# EAGLE design DapLink (EAGLE 9.2.2)

## Sheet 1 of 2
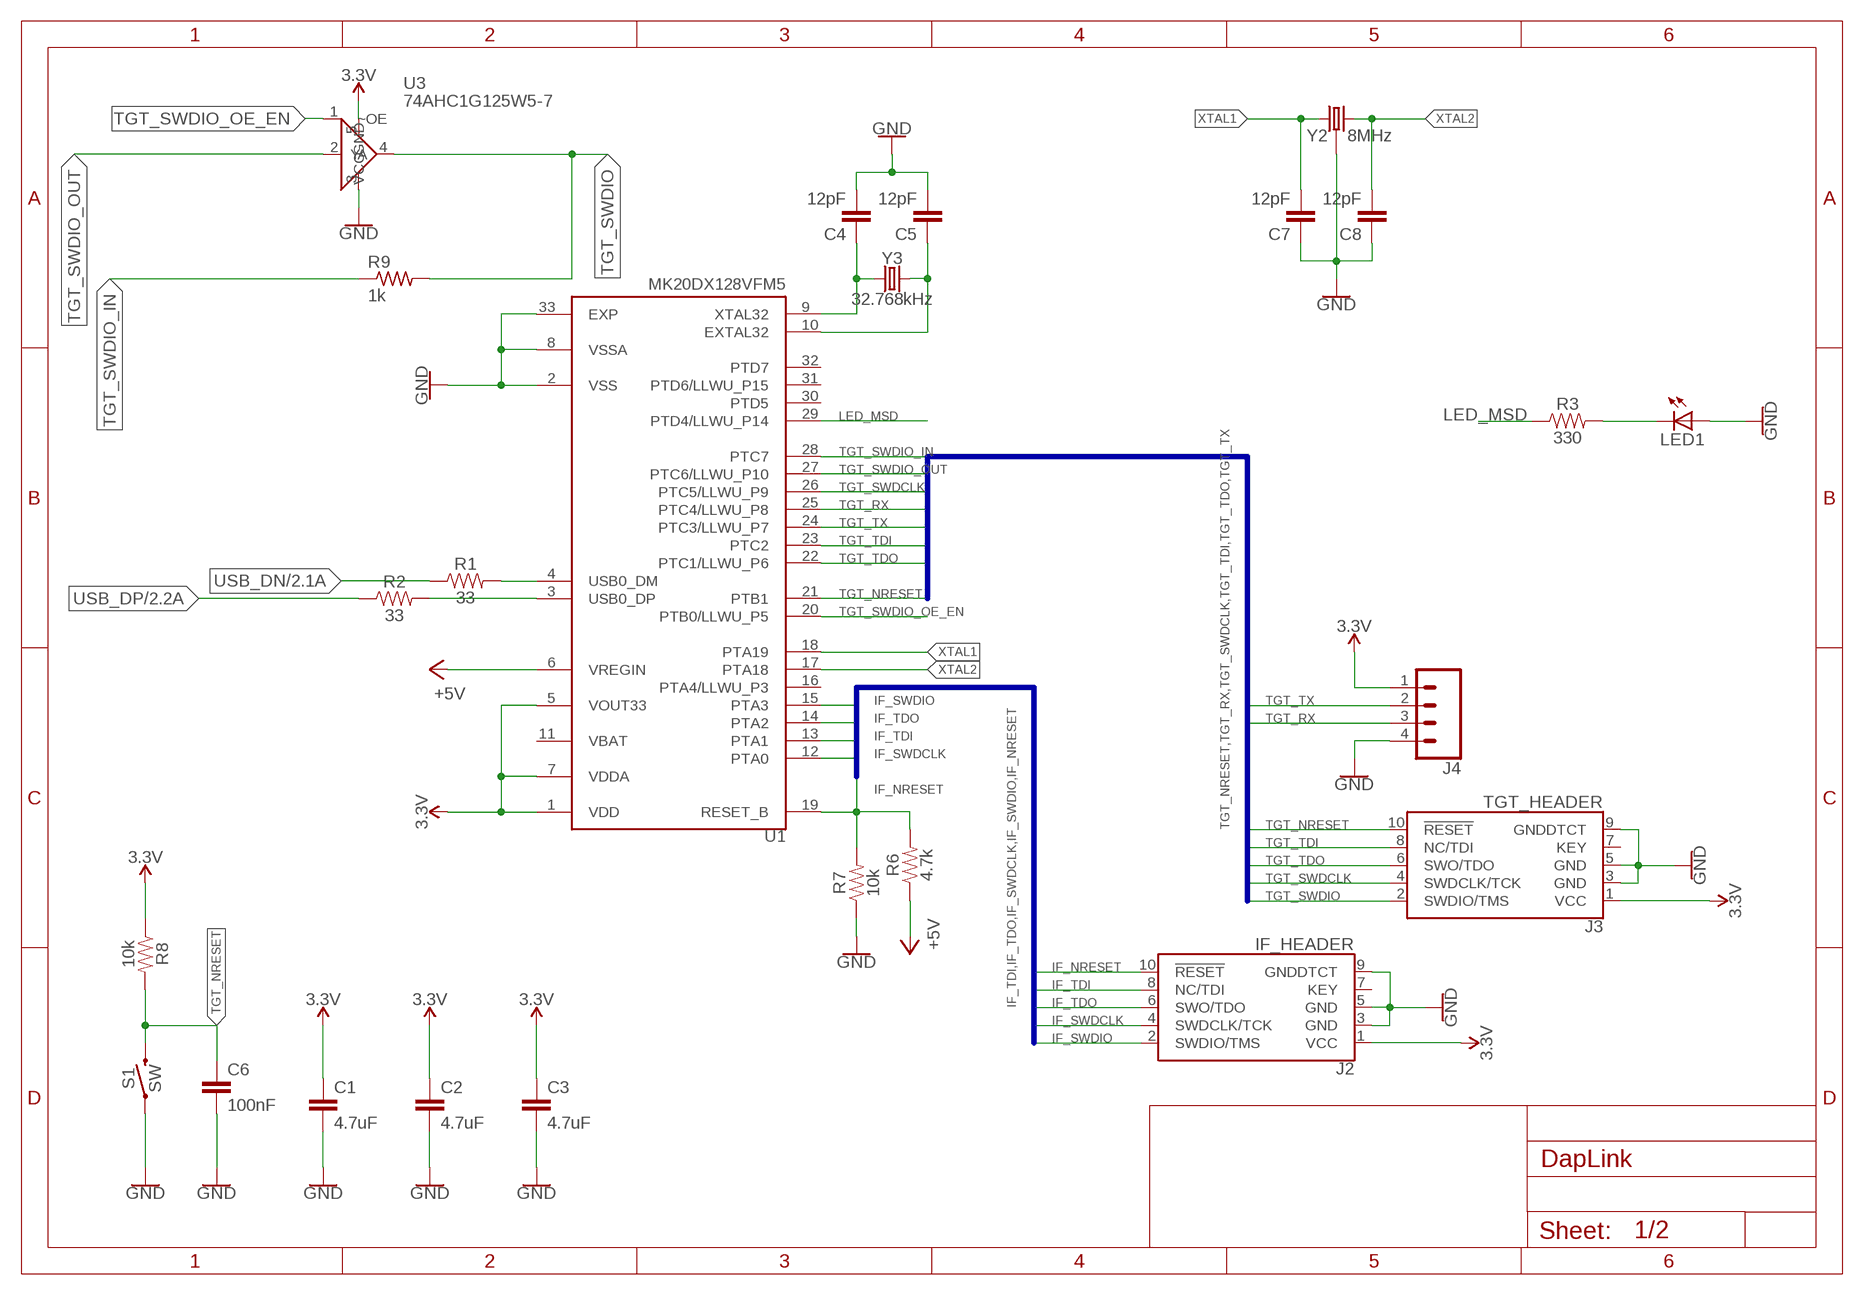
[diagram p0: schematic, sheet 1]

### Parts
C1  4.7uF  4.7UF0603  [0603]
C2  4.7uF  4.7UF0603  [0603]
C3  4.7uF  4.7UF0603  [0603]
C4  12pF  4.7UF0603  [0603]
C5  12pF  4.7UF0603  [0603]
C6  100nF  4.7UF0603  [0603]
C7  12pF  4.7UF0603  [0603]
C8  12pF  4.7UF0603  [0603]
J2  IF_HEADER  CORTEX_DEBUG_PTH  [2X5-PTH-1.27MM]
J3  TGT_HEADER  CORTEX_DEBUG_PTH  [2X5-PTH-1.27MM]
J4  CONN_04  [1X04]
LED1  LEDCHIP-LED0603  [CHIP-LED0603]
R1  33  1KOHM-0603-1/10W-1%  [0603]
R2  33  1KOHM-0603-1/10W-1%  [0603]
R3  330  1KOHM-0603-1/10W-1%  [0603]
R6  4.7k  1KOHM-0603-1/10W-1%  [0603]
R7  10k  1KOHM-0603-1/10W-1%  [0603]
R8  10k  1KOHM-0603-1/10W-1%  [0603]
R9  1k  R-US_R0603  [R0603]
S1  SW  MOMENTARY-SWITCH-SPST-PTH-6.0MM-KIT  [TACTILE_SWITCH_PTH_6.0MM_KIT]
U1  MK20DX128VFM5  [QFN50P500X500X100-33N]
U3  74AHC1G125W5-7  [SOT95P280X140-5N]
Y2  8MHz  CRYSTAL-GROUNDEDSMD-5X3.2  [CRYSTAL-SMD-5X3.2-4PAD]
Y3  32.768kHz  CRYSTAL-32.768KHZSMD-3.2X1.5  [CRYSTAL-SMD-3.2X1.5MM]

### Nets
3.3V: C1.1 C2.1 C3.1 J2.1(VCC) J3.1(VCC) J4.1 R8.1 U1.1(VDD) U1.5(VOUT33) U1.7(VDDA) U3.5(VCC) ; also sheet 2
+5V: R6.1 U1.6(VREGIN) ; also sheet 2
GND: C1.2 C2.2 C3.2 C4.2 C5.2 C6.2 C7.1 C8.1 J2.3(GND) J2.5(GND) J2.9(GNDDTCT) J3.3(GND) J3.5(GND) J3.9(GNDDTCT) J4.4 LED1.A R7.1 S1.1 U1.2(VSS) U1.8(VSSA) U1.33(EXP) U3.3(GND) Y2.2 Y2.4 ; also sheet 2
IF_NRESET: J2.10(!RESET) R6.2 R7.2 U1.19(RESET_B)
IF_SWDCLK: J2.4(SWDCLK/TCK) U1.12(PTA0)
IF_SWDIO: J2.2(SWDIO/TMS) U1.15(PTA3)
IF_TDI: J2.8(NC/TDI) U1.13(PTA1)
IF_TDO: J2.6(SWO/TDO) U1.14(PTA2)
LED_MSD: R3.1 U1.29(PTD4/LLWU_P14)
N$1: C4.1 U1.9(XTAL32) Y3.P$1
N$2: C5.1 U1.10(EXTAL32) Y3.P$2
N$3: LED1.C R3.2
TGT_NRESET: C6.1 J3.10(!RESET) R8.2 S1.3 U1.21(PTB1)
TGT_RX: J4.3 U1.25(PTC4/LLWU_P8)
TGT_SWDCLK: J3.4(SWDCLK/TCK) U1.26(PTC5/LLWU_P9)
TGT_SWDIO: J3.2(SWDIO/TMS) R9.2 U3.4(Y)
TGT_SWDIO_IN: R9.1 U1.28(PTC7)
TGT_SWDIO_OE_EN: U1.20(PTB0/LLWU_P5) U3.1(~OE)
TGT_SWDIO_OUT: U1.27(PTC6/LLWU_P10) U3.2(A)
TGT_TDI: J3.8(NC/TDI) U1.23(PTC2)
TGT_TDO: J3.6(SWO/TDO) U1.22(PTC1/LLWU_P6)
TGT_TX: J4.2 U1.24(PTC3/LLWU_P7)
USB0_DN [usb]: R1.2 U1.4(USB0_DM)
USB0_DP [usb]: R2.2 U1.3(USB0_DP)
USB_DN [usb]: R1.1 ; also sheet 2
USB_DP [usb]: R2.1 ; also sheet 2
XTAL1: C7.2 U1.18(PTA19) Y2.3
XTAL2: C8.2 U1.17(PTA18) Y2.1
Unconnected: J2.7(KEY) J3.7(KEY) U1.16(PTA4/LLWU_P3) U1.30(PTD5) U1.31(PTD6/LLWU_P15) U1.32(PTD7)

### Buses
IF_TDI,IF_TDO,IF_SWDCLK,IF_SWDIO,IF_NRESET
TGT_NRESET,TGT_RX,TGT_SWDCLK,TGT_TDI,TGT_TDO,TGT_TX

## Sheet 2 of 2
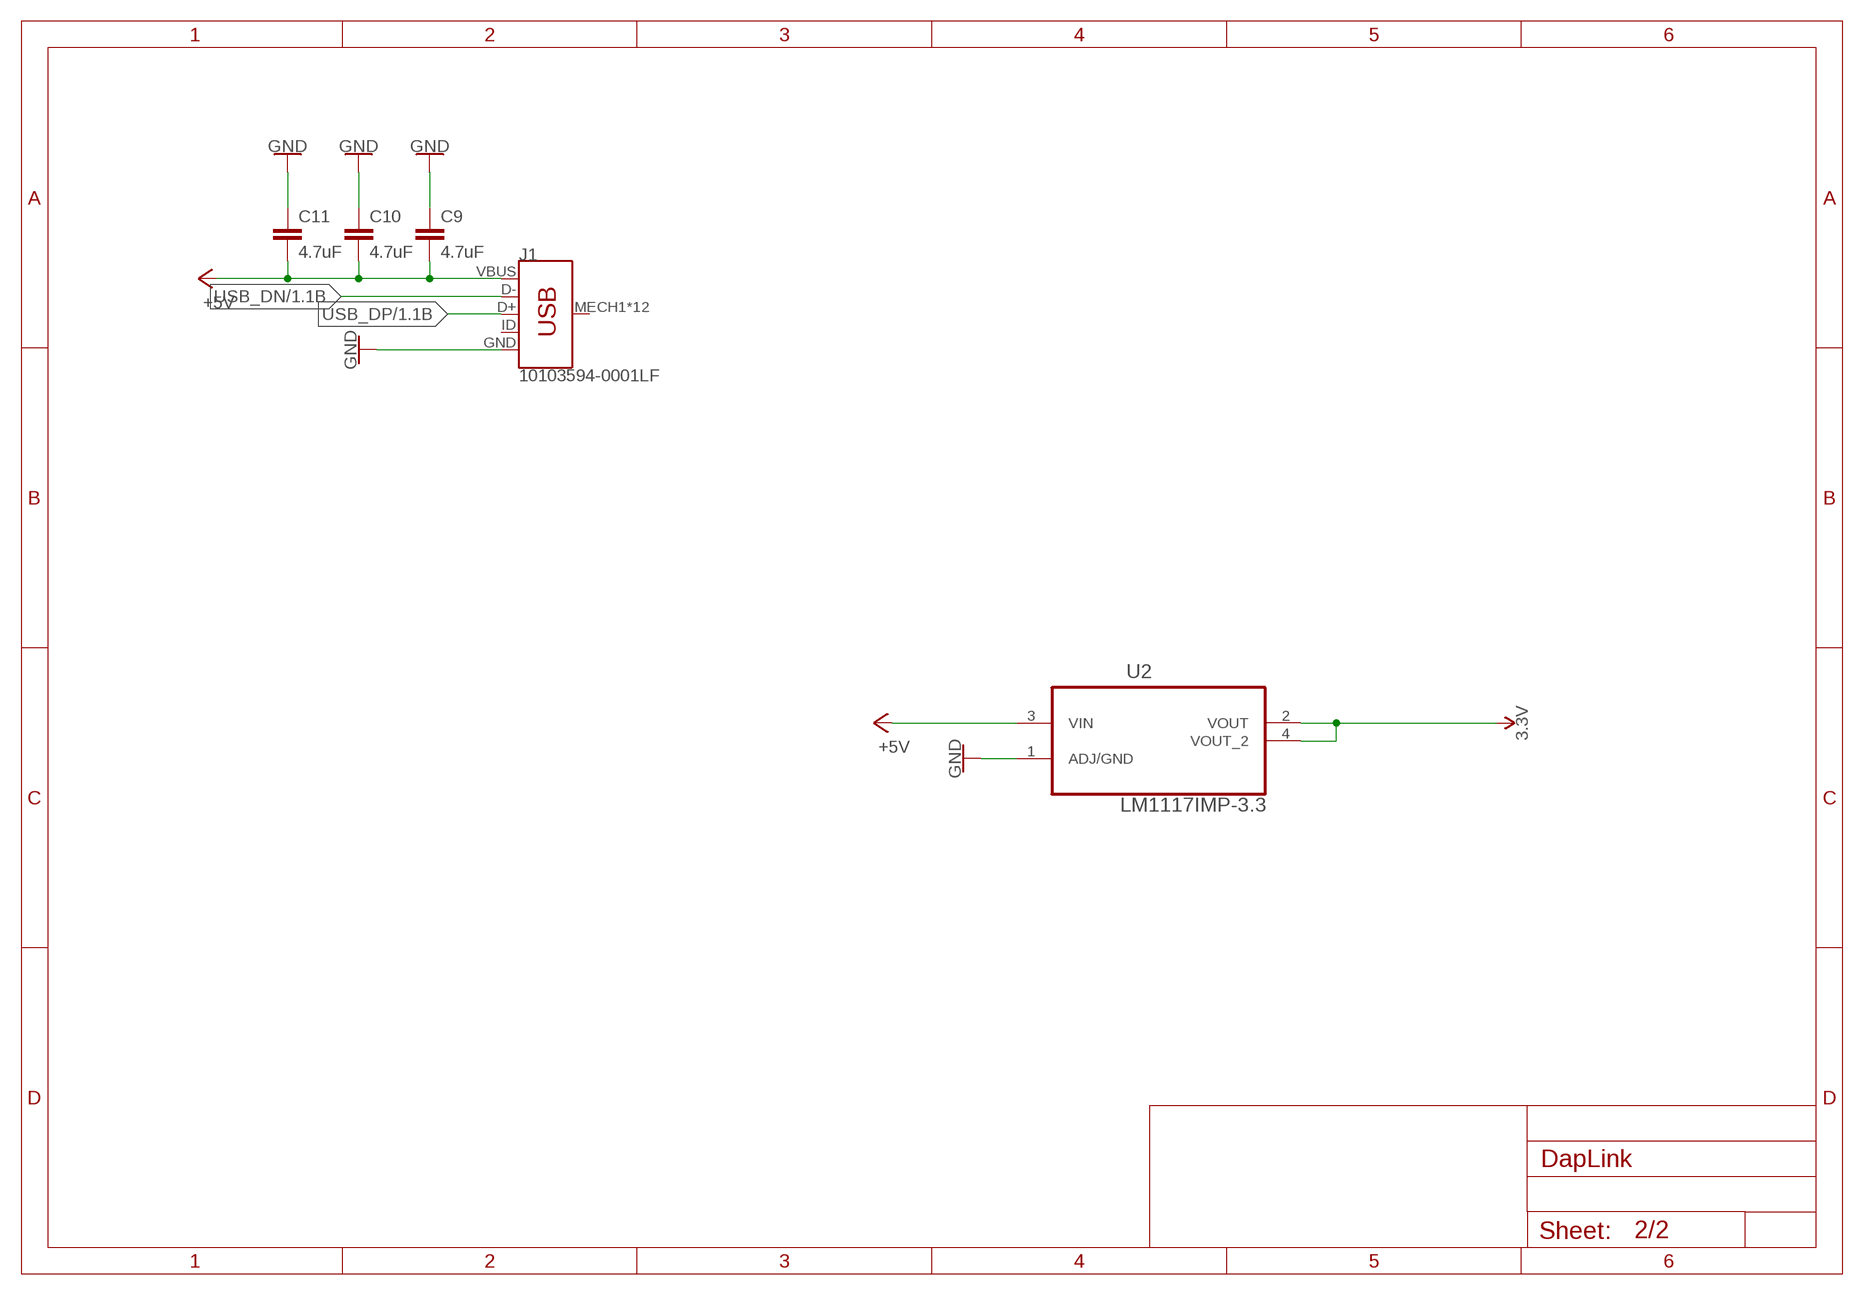
[diagram p1: schematic, sheet 2]

### Parts
C9  4.7uF  C-EUC0603  [C0603]
C10  4.7uF  C-EUC0603  [C0603]
C11  4.7uF  C-EUC0603  [C0603]
J1  10103594-0001LF  [10103594-0001LF]
U2  LM1117IMP-3.3  [SOT230P696X180-4N]

### Nets
3.3V: U2.2(VOUT) U2.4(VOUT_2) ; also sheet 1
+5V: C9.2 C10.2 C11.2 J1.VBUS U2.3(VIN) ; also sheet 1
GND: C9.1 C10.1 C11.1 J1.GND U2.1(ADJ/GND) ; also sheet 1
USB_DN [usb]: J1.D- ; also sheet 1
USB_DP [usb]: J1.D+ ; also sheet 1
Unconnected: J1.ID J1.MECH1(SHIELD) J1.MECH1_2(SHIELD) J1.MECH2(SHIELD) J1.MECH2_2(SHIELD) J1.MECH3(SHIELD) J1.MECH4(SHIELD) J1.MECH5(SHIELD) J1.MECH5_2(SHIELD) J1.MECH6(SHIELD) J1.MECH6_2(SHIELD) J1.MECH7(SHIELD) J1.MECH8(SHIELD)

## Power pins joined to a net without a drawn wire
VBAT: U1.11(VBAT)

## Library data of the parts
C1-C3 = SparkFun-Capacitors:4.7UF: 4.7µF ceramic capacitors A capacitor is a passive two-terminal electrical component used to store electrical energy temporarily in an electric field.; PROD_ID: CAP-08280
C4-C8 = SparkFun-Capacitors:4.7UF: 4.7µF ceramic capacitors A capacitor is a passive two-terminal electrical component used to store electrical energy temporarily in an electric field.; PROD_ID: CAP-08280; VALUE: 4.7uF
C9-C11 = rcl:C-EU: CAPACITOR, European symbol; HEIGHT: 0.8
J1 = Micro USB:10103594-0001LF
J2 J3 = SparkFun-Connectors:CORTEX_DEBUG: Cortex Debug Connector - 10 pin Supports JTAG debug, Serial Wire debug, and Serial Wire Viewer. PTH and SMD connector options available. General Connector Information <http://infocenter.arm.com/help/topic/com.arm.doc.faqs/attached/13634/cortex_debug_connectors.pdf> Products: PTH Connector <http://www.digikey.com/product-detail/en/cnc-tech/3220-10-0100-00/1175-1627-ND/3883661> -via Digi-Key SparkFun PSoc <https://www.sparkfun.com/products/13229> SparkFun T <https://www.sparkfun.com/products/13810>
J4 = SparkFun-Connectors:CONN_04: Multi connection point. Often used as Generic Header-pin footprint for 0.1 inch spaced/style header connections On any of the 0.1 inch spaced packages, you can populate with these: Break Away Headers - Straight <https://www.sparkfun.com/products/116> (PRT-00116) Break Away Male Headers - Right Angle <https://www.sparkfun.com/products/553> (PRT-00553) Female Headers <https://www.sparkfun.com/products/115> (PRT-00115) Break Away Headers - Machine Pin <https://www.sparkfun.com/products/117> (PRT-00117) Break Away Female Headers - Swiss Machine Pin <https://www.sparkfun.com/products/743> (PRT-00743) For SCREWTERMINALS and SPRING TERMINALS visit here: Screw Terimnals on SparkFun.com <https://www.sparkfun.com/search/results?term=Screw+Terminals> (5mm/3.5mm/2.54mm spacing) This device is also useful as a general connection point to wire up your design to another part of your project. Our various solder wires solder well into these plated through hole pads. Hook-Up Wire - Assortment (Stranded, 22 AWG) <https://www.sparkfun.com/products/11375> (PRT-11375) Hook-Up Wire - Assortment (Solid Core, 22 AWG) <https://www.sparkfun.com/products/11367> (PRT-11367) View the entire wire category on our website here <https://www.sparkfun.com/categories/141> Special notes: Molex polarized connector foot print use with SKU : PRT-08231 with associated crimp pins and housings. 1MM SMD Version SKU: PRT-10208; PROD_ID: CONN-09696
LED1 = adafruit:LED: LED OSRAM: - CHIPLED LG R971, LG N971, LY N971, LG Q971, LY Q971, LO R971, LY R971 LH N974, LH R974 LS Q976, LO Q976, LY Q976 LO Q996 - Hyper CHIPLED LW Q18S LB Q993, LB Q99A, LB R99A - SideLED LS A670, LO A670, LY A670, LG A670, LP A670 LB A673, LV A673, LT A673, LW A673 LH A674 LY A675 LS A676, LA A676, LO A676, LY A676, LW A676 LS A679, LY A679, LG A679 - Hyper Micro SIDELED® LS Y876, LA Y876, LO Y876, LY Y876 LT Y87S - SmartLED LW L88C, LW L88S LB L89C, LB L89S, LG L890 LS L89K, LO L89K, LY L89K LS L896, LA L896, LO L896, LY L896 - TOPLED LS T670, LO T670, LY T670, LG T670, LP T670 LSG T670, LSP T670, LSY T670, LOP T670, LYG T670 LG T671, LOG T671, LSG T671 LB T673, LV T673, LT T673, LW T673 LH T674 LS T676, LA T676, LO T676, LY T676, LB T676, LH T676, LSB T676, LW T676 LB T67C, LV T67C, LT T67C, LS T67K, LO T67K, LY T67K, LW E67C LS E67B, LA E67B, LO E67B, LY E67B, LB E67C, LV E67C, LT E67C LW T67C LS T679, LY T679, LG T679 LS T770, LO T770, LY T770, LG T770, LP T770 LB T773, LV T773, LT T773, LW T773 LH T774 LS E675, LA E675, LY E675, LS T675 LS T776, LA T776, LO T776, LY T776, LB T776 LHGB T686 LT T68C, LB T68C - Hyper Mini TOPLED® LB M676 - Mini TOPLED Santana® LG M470 LS M47K, LO M47K, LY M47K Source: http://www.osram.convergy.de/
R1-R3 R6-R8 = SparkFun-Resistors:1KOHM: 1kΩ resistor A resistor is a passive two-terminal electrical component that implements electrical resistance as a circuit element. Resistors act to reduce current flow, and, at the same time, act to lower voltage levels within circuits. - Wikipedia; PROD_ID: RES-07856; VALUE: 1k
R9 = rcl:R-US_: RESISTOR, American symbol
S1 = SparkFun-Switches:MOMENTARY-SWITCH-SPST: Momentary Switch (Pushbutton) - SPST Normally-open (NO) SPST momentary switches (buttons, pushbuttons). Variants PTH-12MM - 12mm square, through-hole Momentary Pushbutton Switch - 12mm Square <https://www.sparkfun.com/products/9190> (COM-09190) PTH-6.0MM, PTH-6.0MM-KIT - 6.0mm square, through-hole Mini Pushbutton Switch <https://www.sparkfun.com/products/97> (COM-00097) KIT package intended for soldering kit's - only one side of pads' copper is exposed. PTH-RIGHT-ANGLE-KIT - Right-angle, through-hole Right Angle Tactile Button <https://www.sparkfun.com/products/10791> - Used on SparkFun BigTime Watch Kit <https://www.sparkfun.com/products/11734> SMD-12MM - 12mm square, surface-mount Tactile Button - SMD (12mm) <https://www.sparkfun.com/products/12993> (COM-12993) Used on SparkFun PicoBoard <https://www.sparkfun.com/products/11888> SMD-4.5MM - 4.5mm Square Trackball Switch Used on SparkFun Blackberry Trackballer Breakout <https://www.sparkfun.com/products/13169> SMD-4.6MMX2.8MM - 4.60mm x 2.80mm, surface mount Used on SparkFun SAMD21 Mini Breakout <https://www.sparkfun.com/products/13664> SMD-5.2MM, SMD-5.2-REDUNDANT - 5.2mm square, surface-mount Mini Pushbutton Switch - SMD <https://www.sparkfun.com/products/8720> (COM-08720) Used on Arduino Pro Mini <https://www.sparkfun.com/products/11114> REDUNDANT package connects both switch circuits together SMD-6.0X3.5MM - 6.0 x 3.5mm, surface mount Momentary Reset Switch SMD <https://www.sparkfun.com/products/8229> (COM-08229) SMD-6.2MM-TALL - 6.2mm square, surface mount Tactile Button - SMD (6mm) <https://www.sparkfun.com/products/12992> Used on SparkFun Digital Sandbox <https://www.sparkfun.com/products/12651> SMD-RIGHT-ANGLE - Right-angle, surface mount Used on SparkFun Block for Intel® Edison - Arduino <https://www.sparkfun.com/products/13036>; PROD_ID: SWCH-08441; SF_SKU: COM-00097
U1 = MK20DX128VFM5:MK20DX128VFM5: Kinetis K20: 50MHz Cortex-M4 Performance MCU, 160KB Flash, 16KB SRAM, Full-Speed USB, 32-QFN; AVAILABILITY: Good; DESCRIPTION: MCU 32-bit Kinetis K20 ARM Cortex M4 RISC 128KB Flash 1.8V/2.5V/3.3V 32-Pin QFN EP Tray; MF: NXP; MP: MK20DX128VFM5; PACKAGE: QFN-32 Freescale Semiconductor; PRICE: 3.94 USD
U2 = LM1117:LM1117IMP-3.3: IC REG LDO 800MA 3.3V; MPN: LM1117IMP-3.3; OC_FARNELL: 1469051; OC_NEWARK: 41K3450; PACKAGE: SOT-223; SUPPLIER: National Semiconductor
U3 = SamacSys_Parts:74AHC1G125W5-7: DiodesZetex 74AHC1G125W5-7, Buffer, Bus driver 3-State, Non-Inverting, 2 5.5 V, 5-Pin SOT-25 Source: Datasheet <http://componentsearchengine.com/Datasheets/1/74AHC1G125W5-7.pdf>; ARROW_PART_NUMBER: 74AHC1G125W5-7; ARROW_PRICE/STOCK: https://www.arrow.com/en/products/74ahc1g125w5-7/diodes-incorporated; DESCRIPTION: DiodesZetex 74AHC1G125W5-7, Buffer, Bus driver 3-State, Non-Inverting, 2 5.5 V, 5-Pin SOT-25; HEIGHT: mm; MANUFACTURER_NAME: Diodes Inc.; MANUFACTURER_PART_NUMBER: 74AHC1G125W5-7; RS_PART_NUMBER: 8228669; RS_PRICE/STOCK: http://uk.rs-online.com/web/p/products/8228669
Y2 = Sparkfun-clocks:CRYSTAL-GROUNDED: Crystals w/ Ground Pin (Generic) These are passive quartz crystals, which can be used as a clock source for a microcontroller. Crystal's are usually two-terminal devices. A third terminal may be optionally connected to ground, as recommended by the manufaturer.
Y3 = Sparkfun-clocks:CRYSTAL-32.768KHZ: 32.768kHz Crystal Frequency: 32.768kHz Frequency Stability: ±20ppm Load Capacitance: 12.5pF (PTH-2X6 & SMD-3.2X1.5), 6pF (SMD-2X6) SparkFun Products: SparkFun BigTime Watch Kit <https://www.sparkfun.com/products/11734> SparkFun nRF52832 Breakout <https://www.sparkfun.com/products/13990> SparkFun Real Time Clock Module <https://www.sparkfun.com/products/12708>; PROD_ID: XTAL-13062

## Net classes
0 default: width 0.152 mm, drill 0.305 mm, clearance 0.254 mm
1 usb: width 0.203 mm, drill 0.305 mm, clearance 0.254 mm

## Board
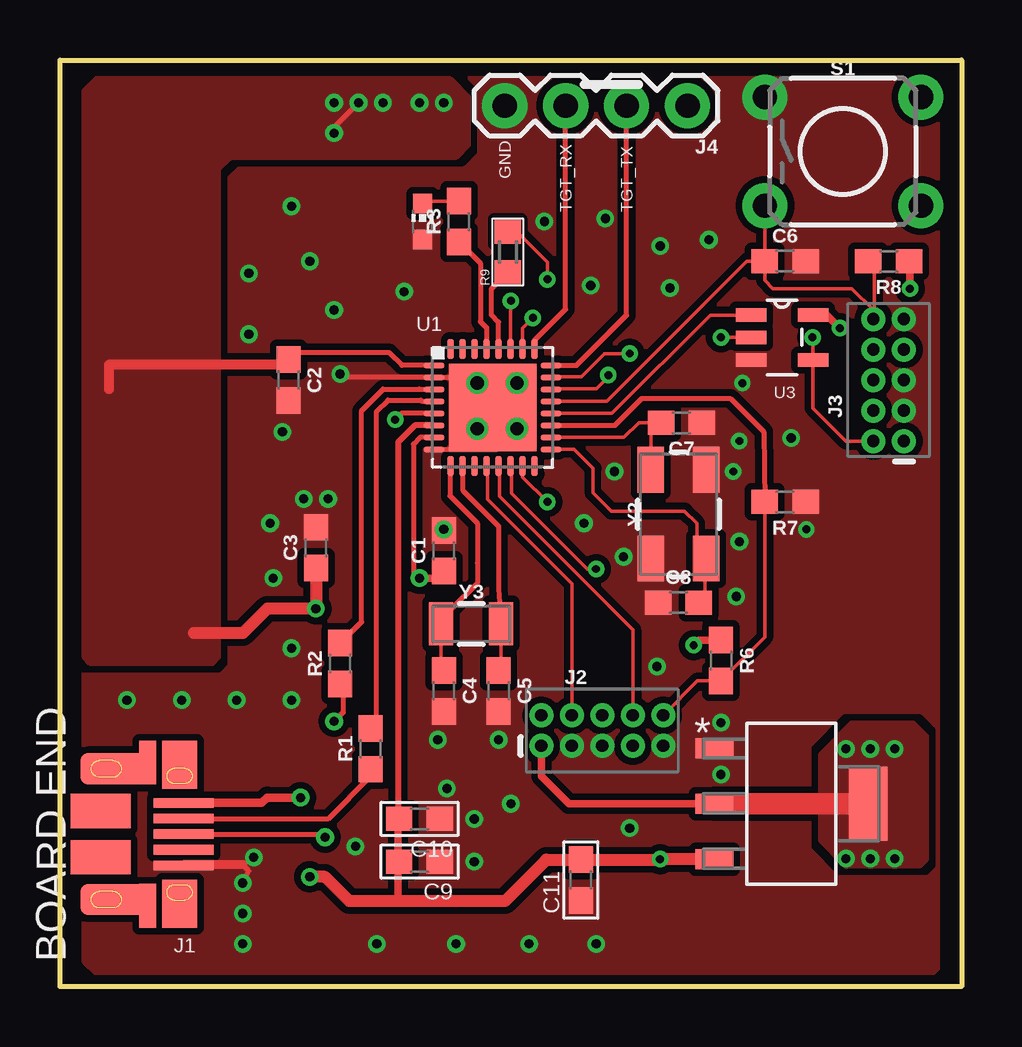
[diagram p2: board, top side]
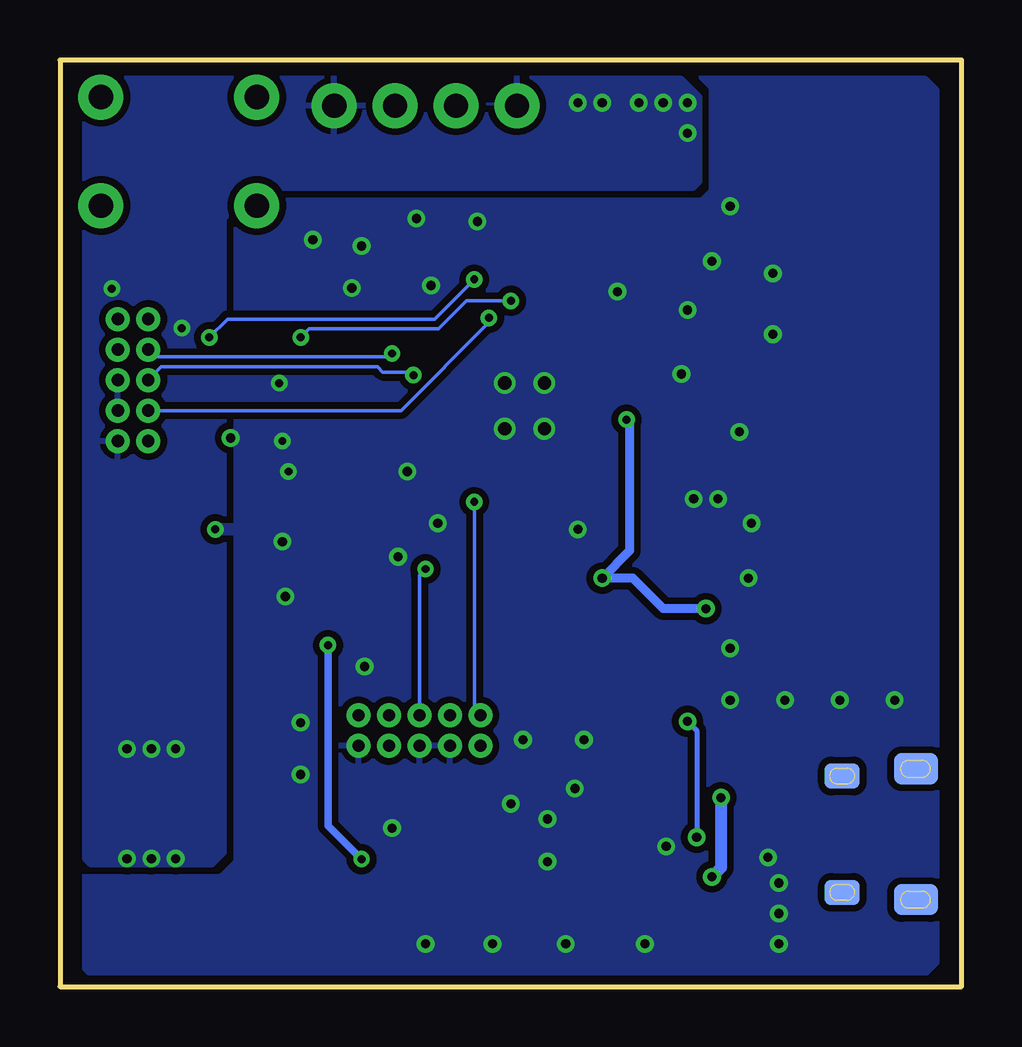
[diagram p3: board, bottom side, seen from below]

Size 37.59 x 38.61 mm. Coordinates in mm from the lower left corner, seen from the top.
Outline: 0,38.61 37.59,38.61 37.59,0 0,0 0,38.61
Copper layers (1*16): Top 0.0356mm / dielectric 1.5011mm / Bottom 0.0356mm
Design rules "oshpark-2layer": minimum track width 6mil, minimum drill 13mil, track to track 6mil, track to pad 6mil, pad to pad 6mil, via to via 6mil, smd to smd 6mil, copper to edge 15mil, drill to drill 6mil, minimum pad ring 7mil, minimum via ring 7mil, stop-mask expansion 2.5mil, vias tented up to drill 0mil, thermal gap 10mil

### Footprints (pad centres in the part's own frame; a part is rotated, then mirrored left to right if it is on the bottom)
0603 = smd 1.1 x 1: 1 -0.85,0; 2 0.85,0
C0603 = smd 1.1 x 1: 1 -0.85,0; 2 0.85,0
10103594-0001LF = smd 0.4 x 2.5: D+ 0,4.9; D- -0.65,4.9; GND 1.3,4.9; ID 0.65,4.9; VBUS -1.3,4.9 | smd 2 x 1.46: MECH1 -2.9,4.73; MECH2 2.9,4.73 | smd 1.05 x 1.46 bottom: MECH1_2 -2.425,4.73; MECH2_2 2.425,4.73 | smd 1.825 x 0.7: MECH3 -2.987,3.4; MECH4 2.987,3.4 | smd 1.3 x 3.15: MECH5 -2.725,2.175; MECH6 2.725,2.175 | smd 1.3 x 1.85 bottom: MECH5_2 -2.725,1.651; MECH6_2 2.725,1.651 | smd 1.425 x 2.5: MECH7 -0.963,1.45; MECH8 0.963,1.45
2X5-PTH-1.27MM = drill 0.508 pad 1: 1 -2.54,-0.635; 2 -2.54,0.635; 3 -1.27,-0.635; 4 -1.27,0.635; 5 0,-0.635; 6 0,0.635; 7 1.27,-0.635; 8 1.27,0.635; 9 2.54,-0.635; 10 2.54,0.635
1X04 = drill 1.016 pad 1.88: 1 0,0; 2 2.54,0; 3 5.08,0; 4 7.62,0
CHIP-LED0603 = smd 0.8 x 0.8: A 0,-0.75; C 0,0.75
R0603 = smd 1 x 1.1: 1 -0.85,0; 2 0.85,0
TACTILE_SWITCH_PTH_6.0MM_KIT = drill 1.016 pad 1.88: 1 -3.251,2.261; 2 3.251,2.261; 3 -3.251,-2.261; 4 3.251,-2.261
QFN50P500X500X100-33N = smd 0.84 x 0.26: 1 -2.435,1.75; 2 -2.435,1.25; 3 -2.435,0.75; 4 -2.435,0.25; 5 -2.435,-0.25; 6 -2.435,-0.75; 7 -2.435,-1.25; 8 -2.435,-1.75; 17 2.435,-1.75; 18 2.435,-1.25; 19 2.435,-0.75; 20 2.435,-0.25; 21 2.435,0.25; 22 2.435,0.75; 23 2.435,1.25; 24 2.435,1.75 | smd 0.26 x 0.84: 9 -1.75,-2.435; 10 -1.25,-2.435; 11 -0.75,-2.435; 12 -0.25,-2.435; 13 0.25,-2.435; 14 0.75,-2.435; 15 1.25,-2.435; 16 1.75,-2.435; 25 1.75,2.435; 26 1.25,2.435; 27 0.75,2.435; 28 0.25,2.435; 29 -0.25,2.435; 30 -0.75,2.435; 31 -1.25,2.435; 32 -1.75,2.435 | smd 3.65 x 3.65: 33 0,0
SOT230P696X180-4N = smd 1.6 x 0.838: 1 -3.2,2.311; 2 -3.2,0; 3 -3.2,-2.311 | smd 1.6 x 3.099: 4 3.2,0
SOT95P280X140-5N = smd 1.27 x 0.559: 1 -1.295,0.94; 2 -1.295,0; 3 -1.295,-0.94; 4 1.295,-0.94; 5 1.295,0.94
CRYSTAL-SMD-5X3.2-4PAD = smd 1.9 x 1.1: 1 -1.85,-1.15; 2 1.85,-1.15; 3 1.85,1.15; 4 -1.85,1.15
CRYSTAL-SMD-3.2X1.5MM = smd 1 x 1.8: P$1 -1.25,0; P$2 1.25,0

### Placement (x,y rotation side)
C1  16,18.16 90 top
C2  9.53,25.27 270 top
C3  10.67,18.29 90 top
C4  16,12.32 270 top
C5  18.29,12.32 270 top
C6  30.23,30.23 0 top
C7  25.91,23.5 180 top
C8  25.78,16 0 top
C9  14.99,5.21 180 top
C10  14.99,6.99 180 top
C11  21.72,4.45 90 top
J1  0.25,6.35 270 top
J2  22.61,10.67 0 top
J3  34.54,25.27 90 top
J4  26.16,36.7 180 top
LED1  15.11,31.88 0 top
R1  12.95,9.91 90 top
R2  11.68,13.46 90 top
R3  16.64,31.88 90 top
R6  27.56,13.59 270 top
R7  30.23,20.19 180 top
R8  34.54,30.23 180 top
R9  18.67,30.61 90 top
S1  32.64,34.8 0 top
U1  18.03,24.13 0 top
U2  30.48,7.62 0 top
U3  30.1,27.05 0 top
Y2  25.78,19.68 90 top
Y3  17.14,15.11 0 top

### Tracks (layer width: path | path; a pad name or v marks a point on that pad's centre or on a via)
3.3V  (via drill 0.33, 0.38)
  Top 0.152: 9.53,26.42 C2.1
  Top 0.203: 11.43,35.81 v12.45,36.83 | U1.7 15.01,22.88 14.73,22.61 14.73,17.02 v14.99,17.02 | U1.1 14.25,25.88 13.72,26.42 9.53,26.42 | U1.5 14.23,23.88 v13.97,23.62
  Top 0.305: J2.1 20.07,8.76 21.21,7.62 U2.2 | v35.43,29.08 35.43,30.19 R8.1 | U3.5 31.95,27.99 v32.51,27.43 | v14.99,17.02 15.71,17.02 C1.1
  Top 0.406: 2.03,24.89 2.03,25.91 9.4,25.91 9.53,26.04 C2.1
  Top 0.508: C3.1 v10.67,15.75 8.64,15.75 7.62,14.73 5.59,14.73
  Top 0.889: U2.4 U2.2
  Bottom 0.381: v10.67,15.75 12.45,15.75 13.72,17.02 v14.99,17.02 13.84,18.16 13.84,23.5 v13.97,23.62
  other vias: 13.46,36.83 14.99,36.83 16,36.83 33.78,9.91 32.77,5.33 34.8,5.33 33.78,5.33 32.77,9.91 34.8,9.91 11.43,36.83 11.43,35.56
  pour Top (isolate 0.279): 11.43,37.08 11.94,37.59 16.26,37.59 16.76,37.08 16.76,35.56 16.51,35.31 11.68,35.31 11.43,35.56
  pour Bottom (isolate 0.279): 10.92,33.53 10.92,37.08 11.68,37.85 36.07,37.85 36.58,37.34 36.58,5.33 36.32,5.08 31.24,5.08 30.73,5.59 30.73,32 29.46,33.27 11.18,33.27
  pour Top (isolate 0.279, no thermals): 31.75,8.38 31.75,9.65 33.02,10.92 35.56,10.92 36.07,10.41 36.07,5.33 35.81,5.08 32.77,5.08 31.75,6.1
  pour Top (isolate 0.279): 1.02,37.34 1.52,37.85 16.26,37.85 17.02,37.08 17.02,35.05 16.51,34.54 7.11,34.54 6.6,34.04 6.6,13.72 6.35,13.46 1.27,13.46 1.02,13.72
+5V  (via drill 0.33, 0.38)
  Top 0.152: C10.2 14.14,6.9 14.1,6.86 | C9.2 14.1,5.21 | 25.01,5.29 v25.02,5.31
  Top 0.254: U1.6 14.79,23.38 14.1,22.68 14.1,6.86
  Top 0.305: R6.1 26.63,14.44 v26.42,14.22 | 14.1,6.86 14.1,5.21 14.1,3.68 13.97,3.56
  Top 0.356: v10.03,7.87 8.64,7.87 8.41,7.65 J1.VBUS
  Top 0.508: U2.3 v25.02,5.31 | v10.41,4.57 11.05,4.57 12.06,3.56 13.97,3.56 18.54,3.56 20.28,5.29 C11.2 25.01,5.29
  Bottom 0.305: v26.42,14.22 26.42,6.71 v25.02,5.31
  Bottom 0.508: v10.03,7.87 10.03,4.95 v10.41,4.57
GND  (via drill 0.33, 0.38, 0.55)
  Top 0.203: U1.8 18.19,22.38 v19.05,23.24 16.91,25.38 U1.2 11.74,25.38 | v7.62,4.32 7.87,4.83 7.62,5.08 | 5.18,5.08 J1.GND
  Top 0.381: 7.62,5.08 5.18,5.08
  other vias: 7.62,3.05 17.4,25.15 17.4,23.24 19.05,25.15 7.62,1.78 10.41,30.23 7.87,27.18 9.65,32.51 10.16,20.32 11.18,20.32 11.68,25.53 8.76,19.3 2.79,11.94 5.08,11.94 7.37,11.94 9.65,11.94 16.13,8.26 18.8,7.62 23.75,6.6 13.21,1.78 16.51,1.78 19.56,1.78 22.35,1.78 23.5,17.91 22.12,29.21 22.73,32 9.27,23.11 28.45,25.15 31.12,19.05 7.87,29.72 11.43,28.19 30.48,22.86 27.05,31.11 16,19.05 25.43,29.11 9.65,14.1 8.89,17.02 15.75,10.29 18.29,10.29 28.32,22.73 28.07,21.46 17.27,5.21 17.27,6.99 12.32,5.84 24.89,13.34 21.84,19.3 23.11,21.46 28.19,16.26 28.32,18.54 14.35,28.96 20.19,31.88 25.02,30.86 27.56,8.84 27.56,11 8.08,5.38
  pour Bottom (isolate 0.279, rank 2): 1.02,1.02 1.02,37.34 1.52,37.85 36.07,37.85 36.58,37.34 36.58,0.76 36.32,0.51 1.52,0.51
  pour Top (isolate 0.279, rank 2, no thermals): 1.02,1.02 1.02,37.34 1.52,37.85 36.07,37.85 36.58,37.34 36.58,0.76 36.32,0.51 1.52,0.51
IF_NRESET
  Top 0.152: J2.10 26.58,12.74 R6.2 29.38,14.56 R7.2
  Top 0.203: U1.19 23.13,23.38 24.26,24.51 27.94,24.51 29.34,23.11 R7.2
IF_SWDCLK
  Top 0.152: J2.4 21.34,16.79 17.82,20.3 17.82,21.66 U1.12
IF_SWDIO  (via drill 0.33)
  Top 0.152: U1.15 19.28,21.23 v20.32,20.19
  Bottom 0.152: v20.32,20.19 20.32,11.56 J2.2
IF_TDI
  Top 0.152: J2.8 23.88,14.88 18.32,20.43 18.32,21.66 U1.13
IF_TDO  (via drill 0.33)
  Top 0.152: U1.14 18.82,21.66 18.82,20.56 21.98,17.4 v22.35,17.4
  Bottom 0.152: v22.35,17.4 22.61,17.14 J2.6
LED_MSD
  Top 0.203: R3.1 17.53,30.13 17.53,27.71 17.78,27.45 U1.29
N$1
  Top 0.152: Y3.P$1 15.89,13.28 C4.1
  Top 0.203: U1.9 16.26,21.59 16.26,20.45 17.4,19.3 17.4,17.65 17.4,16.81 16.28,15.69 Y3.P$1
N$2
  Top 0.152: Y3.P$2 18.39,13.28 C5.1
  Top 0.203: U1.10 16.78,20.68 18.29,19.18 18.29,16.58 Y3.P$2
N$3
  Top 0.152: R3.2 15.21,32.73 LED1.C
TGT_NRESET
  Top 0.152: C6.1 28.64,30.23 22.79,24.38 U1.21 | C6.1 29.38,32.53 S1.3 | C6.1 29.38,29.43 29.72,29.08 33.02,29.08 33.91,28.19 J3.10 33.95,27.85 33.95,29.97 R8.2
TGT_RX
  Top 0.203: J4.3 21.08,28.22 19.78,26.92 U1.25
TGT_SWDCLK  (via drill 0.33)
  Top 0.152: U1.26 19.28,27.44 v19.71,27.86
  Bottom 0.152: v19.71,27.86 19.71,27.67 23.38,24 J3.4
TGT_SWDIO  (via drill 0.33)
  Top 0.152: J3.2 32.77,22.73 31.39,24.11 U3.4 31.39,27.03 v31.37,27.05 | R9.2 19.05,31.46 20.32,30.19 v20.32,29.46
  Bottom 0.152: v20.32,29.46 21.97,27.81 30.61,27.81 v31.37,27.05
TGT_SWDIO_IN
  Top 0.203: U1.28 18.28,27.69 17.99,27.99 17.99,29.07 R9.1
TGT_SWDIO_OE_EN
  Top 0.152: U1.20 23.02,23.88 27.11,27.98 28.79,27.98 U3.1
TGT_SWDIO_OUT  (via drill 0.33)
  Top 0.152: U3.2 v27.56,27.05 | v18.8,28.57 v18.78,28.56 U1.27
  Bottom 0.152: v27.56,27.05 27.2,27.41 21.8,27.41 20.63,28.57 v18.8,28.57
TGT_TDI  (via drill 0.33)
  Top 0.152: v23.75,26.38 22.69,26.38 21.73,25.42 20.51,25.42 U1.23
  Bottom 0.152: v23.75,26.38 23.88,26.25 33.62,26.25 J3.8
TGT_TDO  (via drill 0.33)
  Top 0.152: U1.22 20.51,24.92 22.37,24.92 22.86,25.41 v22.86,25.48
  Bottom 0.152: v22.86,25.48 22.99,25.6 24.14,25.6 24.36,25.82 33.36,25.82 J3.6
TGT_TX
  Top 0.203: U1.24 21.54,25.88 23.62,27.97 J4.2
USB0_DN
  Top 0.203: 15.24,24.38 15.5,24.38 U1.4 15.58,24.39 15.08,24.39 15.04,24.43 13.67,24.43 13.21,23.98 13.21,11.01 R1.2
USB0_DP
  Top 0.203: U1.3 arc90 15.59,24.89 15.49,24.89 14.99,24.89 13.46,24.89 12.57,24 12.57,15.2 R2.2
USB_DN
  Top 0.203: J1.D- 11.19,7 12.95,8.76 R1.1
USB_DP  (via drill 0.38)
  Top 0.203: J1.D+ 10.92,6.35 v11.05,6.22 | v11.43,11.05 11.81,11.43 11.81,12.49 R2.1
  Bottom 0.203: v11.43,11.05 11.05,10.67 v11.05,6.22
XTAL1
  Top 0.152: U1.18 23.52,22.88 24.13,23.5 25.02,23.5 | 25.02,23.5 C7.2 | Y2.3 24.63,23.11 25.02,23.5
XTAL2
  Top 0.152: C8.2 26.89,16.26 26.89,17.79 Y2.1 26.54,18.22 26.54,19.3 26.04,19.81 22.99,19.81 22.23,20.57 22.23,21.59 21.44,22.38 U1.17

### Text on the board
tPlace: GND | TGT_RX | TGT_TX